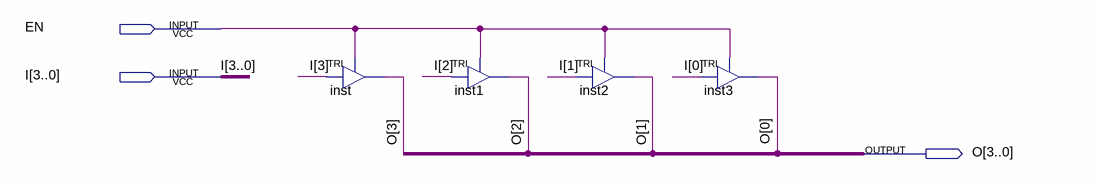
[diagram p0: schematic sheet]
// Quartus schematic tri4bit.bdf as structural Verilog: 4 symbols, 3 pins
module tri4bit (
  input  EN,
  input  [3:0] I,
  output [3:0] O
);

  TRI inst (.IN(I[3]), .OE(EN), .OUT(O[3]));
  TRI inst1 (.IN(I[2]), .OE(EN), .OUT(O[2]));
  TRI inst2 (.IN(I[1]), .OE(EN), .OUT(O[1]));
  TRI inst3 (.IN(I[0]), .OE(EN), .OUT(O[0]));
endmodule
